# Altium schematic sheet discharge-circuit.SchDoc: discharge-circuit
size A4; Date: 05.10.2017; CheckedBy: UNCHECKED; Author: Leon Loeser; Organization: Baltic Racing; Address1: Zur Schwedenschanze 15; Address2: Haus 18; Address3: 18435 Stralsund; Revision: 1.1; SheetNumber: 1; SheetTotal: 3; Rules: EV4.9; ProjectName: Projekt
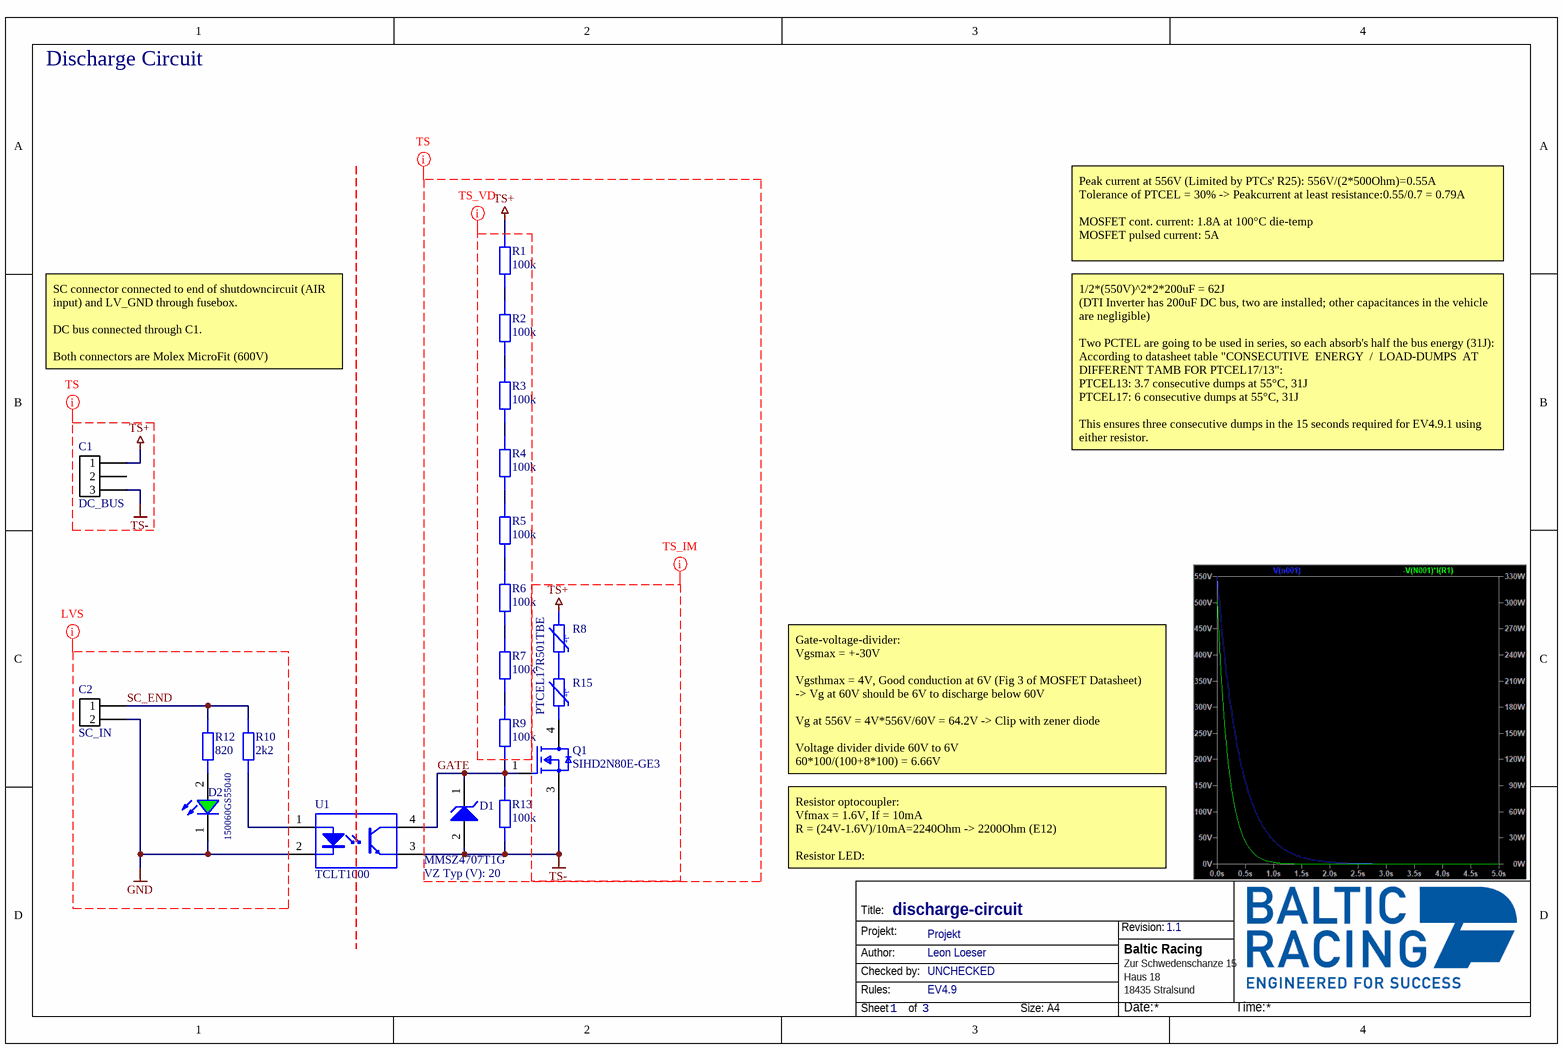
[diagram p0: discharge-circuit.SchDoc]

## Parts
C1  DC_BUS  [43650-0309]
C2  SC_IN  [43650-0200]
D1  MMSZ4707T1G  VZ Typ (V): 20  [ONSC-SOD-123-2-425-04_V]
D2  150060GS55040  [WL-SMCW_0603_H=0.7]
Q1  SIHD2N80E-GE3  [FP-T16-0236-MFG]
R1  value 100k  [STACKPOLE CSR1206]  (hidden comment: SMD Resistor)
R2  value 100k  [STACKPOLE CSR1206]  (hidden comment: SMD Resistor)
R3  value 100k  [STACKPOLE CSR1206]  (hidden comment: SMD Resistor)
R4  value 100k  [STACKPOLE CSR1206]  (hidden comment: SMD Resistor)
R5  value 100k  [STACKPOLE CSR1206]  (hidden comment: SMD Resistor)
R6  value 100k  [STACKPOLE CSR1206]  (hidden comment: SMD Resistor)
R7  value 100k  [STACKPOLE CSR1206]  (hidden comment: SMD Resistor)
R8  PTCEL17R501TBE  [PTCEL17]  (value not drawn)
R9  value 100k  [STACKPOLE CSR1206]  (hidden comment: SMD Resistor)
R10  value 2k2  [STACKPOLE CSR0603]  (hidden comment: SMD Resistor)
R12  value 820  [STACKPOLE CSR0603]  (hidden comment: SMD Resistor)
R13  value 100k  [STACKPOLE CSR0603]  (hidden comment: SMD Resistor)
R15  PTCEL17R501TBE  [PTCEL17]
U1  TCLT1000  [VISH-SOP4L-4_V]

## Nets
GND: C2.2 D2.1(K) U1.2(C)
TS+: C1.1 R1.2 R8.1
TS-: C1.3 D1.2(A) Q1.3(S) R13.1 U1.3(E)
GATE: D1.1(K) Q1.1(G) R9.1 R13.2 U1.4(C)
SC_END: C2.1 R10.1 R12.2
NetD2_2: D2.2(A) R12.1
NetQ1_4: Q1.4(D) R15.2
NetR1_1: R1.1 R2.2
NetR2_1: R2.1 R3.2
NetR3_1: R3.1 R4.2
NetR4_1: R4.1 R5.2
NetR5_1: R5.1 R6.2
NetR6_1: R6.1 R7.2
NetR7_1: R7.1 R9.2
NetR8_2: R8.2 R15.1
NetR10_2: R10.2 U1.1(A)

Not connected (* = marked no-connect by the designer): C1 2

## Layout directives
net class TS: GATE, TS+, TS-
net class GLVS: GND, SC_END
net class TS_IM: GATE, TS+, TS-
net class TS_VD: GATE, TS+, TS-

## Notes on the sheet
- Discharge Circuit
- Peak current at 556V (Limited by PTCs' R25): 556V/(2*500Ohm)=0.55A
  Tolerance of PTCEL = 30% -> Peakcurrent at least resistance:0.55/0.7 = 0.79A
  MOSFET cont. current: 1.8A at 100°C die-temp
  MOSFET pulsed current: 5A
- SC connector connected to end of shutdowncircuit (AIR input) and LV_GND through fusebox.
  DC bus connected through C1.
  Both connectors are Molex MicroFit (600V)
- 1/2*(550V)^2*2*200uF = 62J
  (DTI Inverter has 200uF DC bus, two are installed; other capacitances in the vehicle are negligible)
  Two PCTEL are going to be used in series, so each absorb's half the bus energy (31J):
  According to datasheet table "CONSECUTIVE  ENERGY  /  LOAD-DUMPS  AT DIFFERENT TAMB FOR PTCEL17/13":
  PTCEL13: 3.7 consecutive dumps at 55°C, 31J
  PTCEL17: 6 consecutive dumps at 55°C, 31J
  This ensures three consecutive dumps in the 15 seconds required for EV4.9.1 using either resistor.
- Gate-voltage-divider:
  Vgsmax = +-30V
  Vgsthmax = 4V, Good conduction at 6V (Fig 3 of MOSFET Datasheet)
  -> Vg at 60V should be 6V to discharge below 60V
  Vg at 556V = 4V*556V/60V = 64.2V -> Clip with zener diode
  Voltage divider divide 60V to 6V
  60*100/(100+8*100) = 6.66V
- Resistor optocoupler:
  Vfmax = 1.6V, If = 10mA
  R = (24V-1.6V)/10mA=2240Ohm -> 2200Ohm (E12)
  Resistor LED:
  Vfmax = 3.4V, If = 25mA
  R = (24V-3.4V)/25mA=832Ohm -> 820Ohm (E12)
- Title:
- Projekt:
- Revision:
- Author:
- Rules:
- Checked by:
- Sheet
- of
- Size:
- A4
- Date:
- Time:
- (in symbol PTCEL17R501TBE) +t°

## Library data of the parts
C1 = MicroFit3.0 3-Pin: Molex Micro-Fit 3.0 3-Pin / 600V / 8.5A
C2 = MicroFit3.0 2-Pin: Molex Micro-Fit 3.0 2-Pin / 600V / 8.5A
D1 = CMP-1060-00328-1: Zener Voltage Regulator, 500 mW, 2-Pin SOD-123, Pb-Free, Tape and Reel; Manufacturer: On Semiconductor; P Max (W): 0.5; ComponentLink2Description: Datasheet; ComponentLink1Description: Manufacturer URL; PackageReference: SOD-123-2-425-04; PackageVersion: Rev. G, 10/2009; DatasheetVersion: Rev. 9; ComponentLink3URL: http://www.onsemi.com/pub_link/Collateral/425-04.PDF; ComponentLink2URL: http://www.onsemi.com/pub_link/Collateral/MMSZ4678T1-D.PDF; PackageDescription: 2-Pin SOD, Body 1.6 x 2.69 mm; Mounting Technology: Surface Mount; Packing: Tape and Reel; ComponentLink1URL: http://www.onsemi.com/; PartNumber: MMSZ4707T1G; ComponentLink3Description: Package Specification; RoHS: Pb-Free
D2 = 150060GS75000: SMT Mono-color Chip LED Waterclear WL-SMCW, size 0603, Green, 3.2 V, 140 deg, 430 mcd; Forward Voltage: 3.2 V; Viewing Angle: 140 deg; Peak Wavelength: 515 nm; Dominant Wavelength: 525 nm; Luminous Intensity: 430 mcd; Chip Technology: InGaN; ComponentLink1Description: Manufacturer; ComponentLink1URL: http://www.we-online.de; ComponentLink2Description: Datasheet; ComponentLink2URL: https://katalog.we-online.de/led/datasheet/150060GS75000.pdf; Part Number: 150060GS75000; Published Date: November 2018; Publisher: Wurth Elektronik; Size: 0603; Operating Temperature: -40 to 85 degC; Emitting Color: Green; Mounting Technology: SMT; Packaging: Tape and Reel
Q1 = CMP-02550-000080-1: MOSFET N-CH 800V 2.8A DPAK; Manufacturer: Vishay; Drain To Source Resistance: 2.38Ω; Reverse Recovery Time: 278ns; Power Dissipation: 62.5W; Reverse Recovery Charge: 900nC; Input Capacitace At Vds: 315pF @ 100V; Number Of Channels: 1; Turn On Delay Time: 11ns; Threshold Vgs Max: 4V; Threshold Vgs Min: 2V; Rthja Max: 62°C/W; Turn Off Delay Time: 19ns; Transconductance: 1S; Depletion Mode: False; Gate Charge At Vgs: 9.8nC @ 10V; Max Forward Diode Voltage: 1.2V; Gate To Source Voltage: 30V; Max Junction Temp: +150°C; Pulse Drain Current: 5A; Drain To Source Voltage: 800V; Lead Free: Yes; Continuous Drain Current: 2.8A; Category: Trans; Temperature Range Low: -55°C; Octopart: https://octopart.com/sihd2n80e-ge3-vishay-84840963; Device Class L3: MOSFETs; Manufacturer Part Number: SIHD2N80E-GE3; Footprint Url: https://www.vishay.com/docs/72594/72594.pdf; ComponentLink2URL: https://www.vishay.com/docs/91987/sihd2n80e.pdf; Device Class L1: Discrete Semiconductors; ComponentLink2Description: Datasheet; Digikey Description: MOSFET N-CH 800V 2.8A DPAK; Temperature: -55°C to +150°C; Device Class L2: Transistors; Number Of N Channels: 1; Height: 2.507mm; Drain To Source Breakdown Voltage: 800V; Automotive: No; RoHS: TRUE; Temperature Range High: +150°C; Package: T16-0236
R1-R7 R9 R10 R12 R13 = SMD Resistor: Resistor with multiple footprints
R8 R15 = PTCEL17R501TBE: PTCEL Series 1000 V 500 Ohm ±30 % Radial Inrush Current Limiter PTC Thermistor; Manufacturer: Vishay BCcomponents; Tolerance: 30%; Supplier 1: Mouser; Manufacturer Part Number: PTCEL17R501TBE; RoHS: No; Stock 1: 130; Pricing 1: 1=3,37000, 5=3,30000, 10=3,15000, 25=3,00000, 50=2,70000, 100=2,55000, 200=2,46000, 500=2,25000, 1000=2,17000, 10000=2,17000 (USD); RoHS Compliant: No; ComponentLink1URL: http://www.vishay.com/docs/29165/ptcel.pdf?src-supplier=Digi-Key; ComponentLink1Description: http://www.vishay.com/docs/29165/ptcel.pdf?src-supplier=Digi-Key; Supplier Part Number 1: 594-PTCEL17R501TBE
U1 = CMP-2000-07234-1: Optocoupler, Phototransistor Output, VCEO 70 V, -55 to 100 degC, 4-Pin SOP (SOP4L), RoHS, Tape and Reel; Manufacturer: Vishay/Semiconductor; Maximum Collector Emitter Voltage: 70V; Input Type: DC; Maximum Reverse Voltage: 6V; Maximum Collector Emitter Saturation Voltage: 300mV; Number of Channels per Chip: 1; Maximum Collector Current: 50mA; Maximum Power Dissipation: 250mW; Maximum Forward Voltage: 1.6V; Maximum Input Current: 60mA; Typical Forward Voltage: 1.25V; Minimum Isolation Voltage: 5000Vrms; Maximum Current Transfer Ratio @ Current: 600%; Manufacturer URL: http://www.vishay.com/; Package: 4SOP; Mounting Technology: SurfaceMount; Category: TransistorandPhotovoltaicOutputPhotoCouplers; Datasheet URL: http://www.vishay.com/docs/83515/tclt1000.pdf; Output Type: DC; Operating Temperature: -40to100°C; Package Description: 4-Pin Small Outline Package Integrated Circuit, Body 4.1 x 7.5 mm, Pitch 2.54 mm; Datasheet Version: Rev. 2.9, 12/2015; Package Reference: SOP4L; Packaging: Tape&Reel